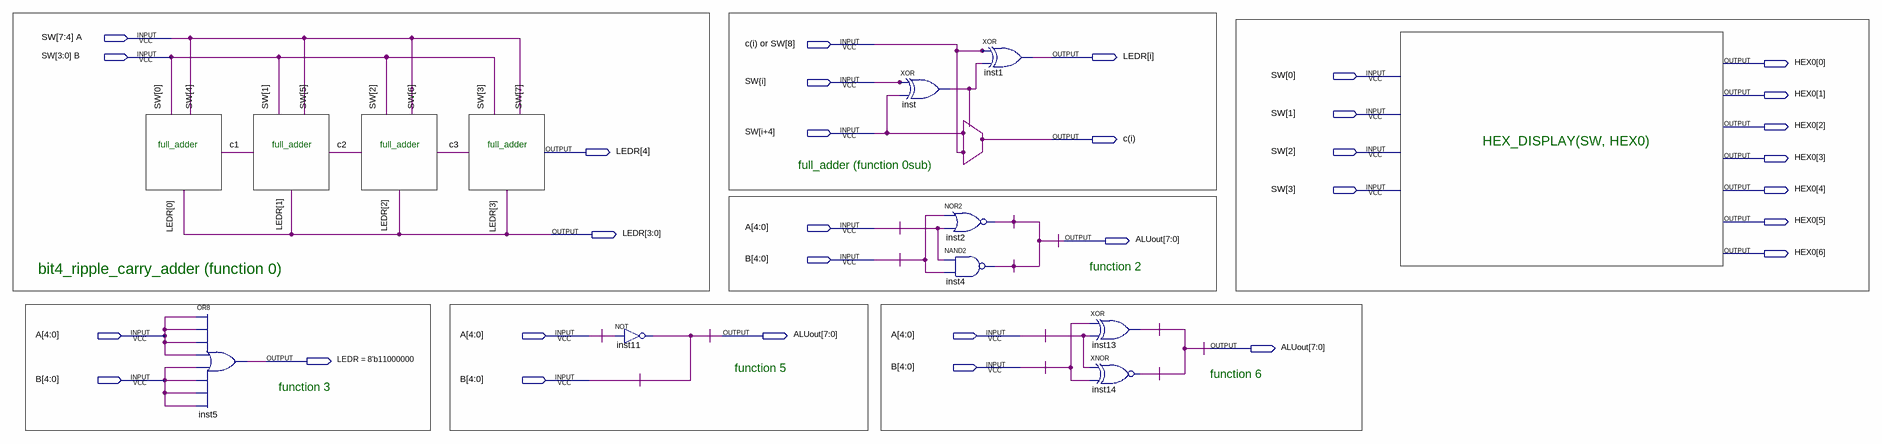
[diagram p0: schematic sheet]
// Quartus schematic arithmaticLogicUnit.bdf as structural Verilog: 8 symbols, 32 pins
module arithmaticLogicUnit (
  input  \SW[7..4]_A ,
  input  [8:8] \c(i)_or_SW ,
  input  \SW[3..0]_B ,
  input  [3:0] SW,
  input  \SW{i] ,
  input  \SW[i+4] ,
  input  [4:0] A,
  input  [4:0] B,
  output \LEDR[i] ,
  output [6:0] HEX0,
  output \c(i) ,
  output [4:0] LEDR,
  output [7:0] ALUout,
  output \LEDR_=_8'b11000000 
);

  wire inst2_out, inst11_out, inst13_out, inst_out, undriven, undriven_2, undriven_3, undriven_4, undriven_5,
       undriven_6, undriven_7;

  or inst5 (\LEDR_=_8'b11000000 , undriven, undriven, undriven, undriven, undriven_2, undriven_2, undriven_2, undriven_2);
  not inst11 (inst11_out, undriven_3);
  xor inst (inst_out, \SW{i] , \c(i)_or_SW [8]);
  nor inst2 (inst2_out, undriven_7, undriven_6);
  nand inst4 (inst2_out, undriven_6, undriven_7);
  xor inst1 (\LEDR[i] , \c(i)_or_SW [8], inst_out);
  xor inst13 (inst13_out, undriven_4, undriven_5);
  xnor inst14 (inst13_out, undriven_5, undriven_4);

  assign \c(i)  = \c(i)_or_SW [8];
  assign LEDR[2:0] = {3{LEDR[3]}};
  assign SW[2:0] = {3{SW[3]}};
  assign \SW[3..0]_B  = SW[3];
  assign \SW[i+4]  = \c(i)_or_SW [8];

  // Other names for the same wires on the sheet: SW[7:4] = {4{\SW[7..4]_A }}

  // Notes on the sheet:
  //   HEX_DISPLAY(SW, HEX0)
  //   full_adder
  //   full_adder
  //   full_adder
  //   full_adder
  //   full_adder (function 0sub)
  //   bit4_ripple_carry_adder (function 0)
  //   function 2
  //   function 5
  //   function 6
  //   function 3
endmodule
